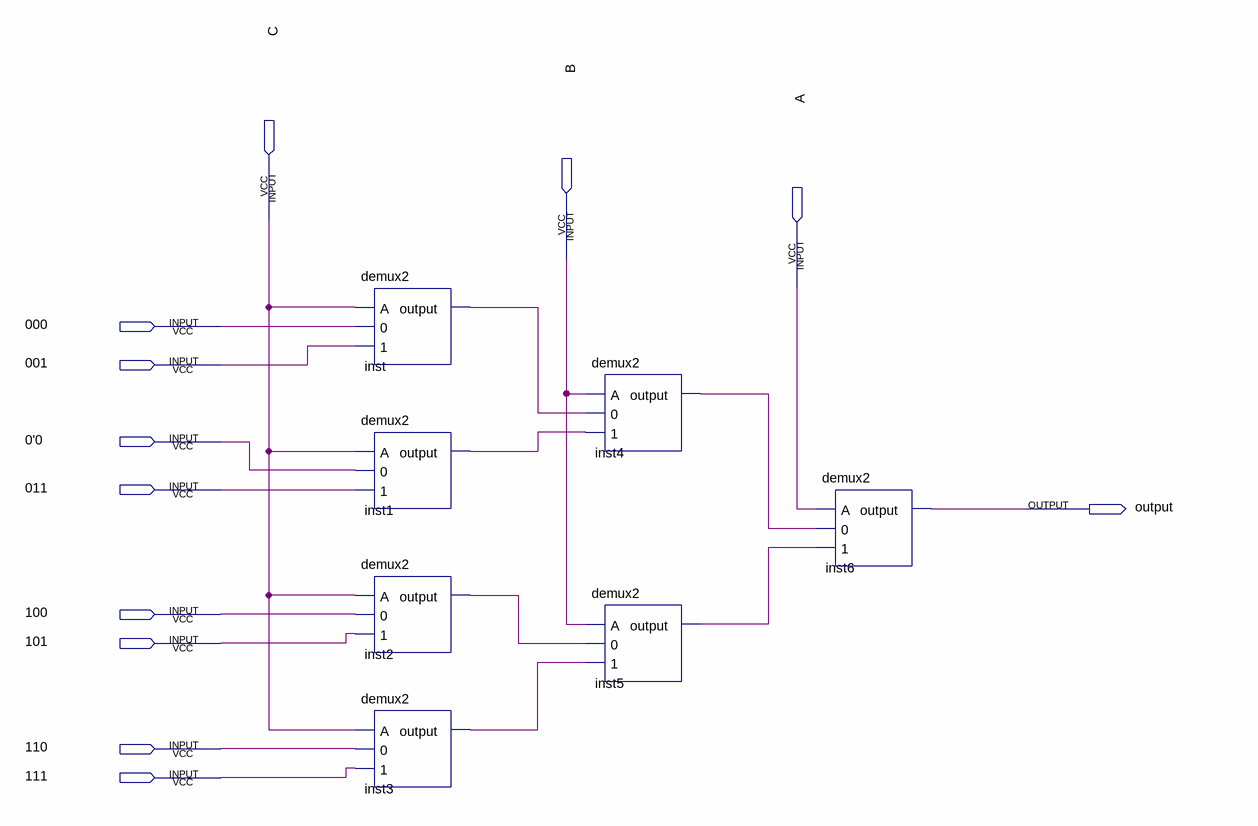
[diagram p0: schematic sheet]
// Quartus schematic demux8.bdf as structural Verilog: 7 symbols, 12 pins
module demux8 (
  input  C,
  input  B,
  input  A,
  input  \000 ,
  input  \001 ,
  input  \0'0 ,
  input  \011 ,
  input  \100 ,
  input  \101 ,
  input  \110 ,
  input  \111 ,
  output \output 
);

  wire inst1_output, inst2_output, inst3_output, inst4_output, inst5_output, inst_output;

  demux2 inst (.A(C), .\0 (\000 ), .\1 (\001 ), .\output (inst_output));
  demux2 inst1 (.A(C), .\0 (\0'0 ), .\1 (\011 ), .\output (inst1_output));
  demux2 inst2 (.A(C), .\0 (\100 ), .\1 (\101 ), .\output (inst2_output));
  demux2 inst3 (.A(C), .\0 (\110 ), .\1 (\111 ), .\output (inst3_output));
  demux2 inst4 (.A(B), .\0 (inst_output), .\1 (inst1_output), .\output (inst4_output));
  demux2 inst5 (.A(B), .\0 (inst2_output), .\1 (inst3_output), .\output (inst5_output));
  demux2 inst6 (.A(A), .\0 (inst4_output), .\1 (inst5_output), .\output (\output ));
endmodule
